# EAGLE design NRF24-mini-SHIM (EAGLE 9.6.2)
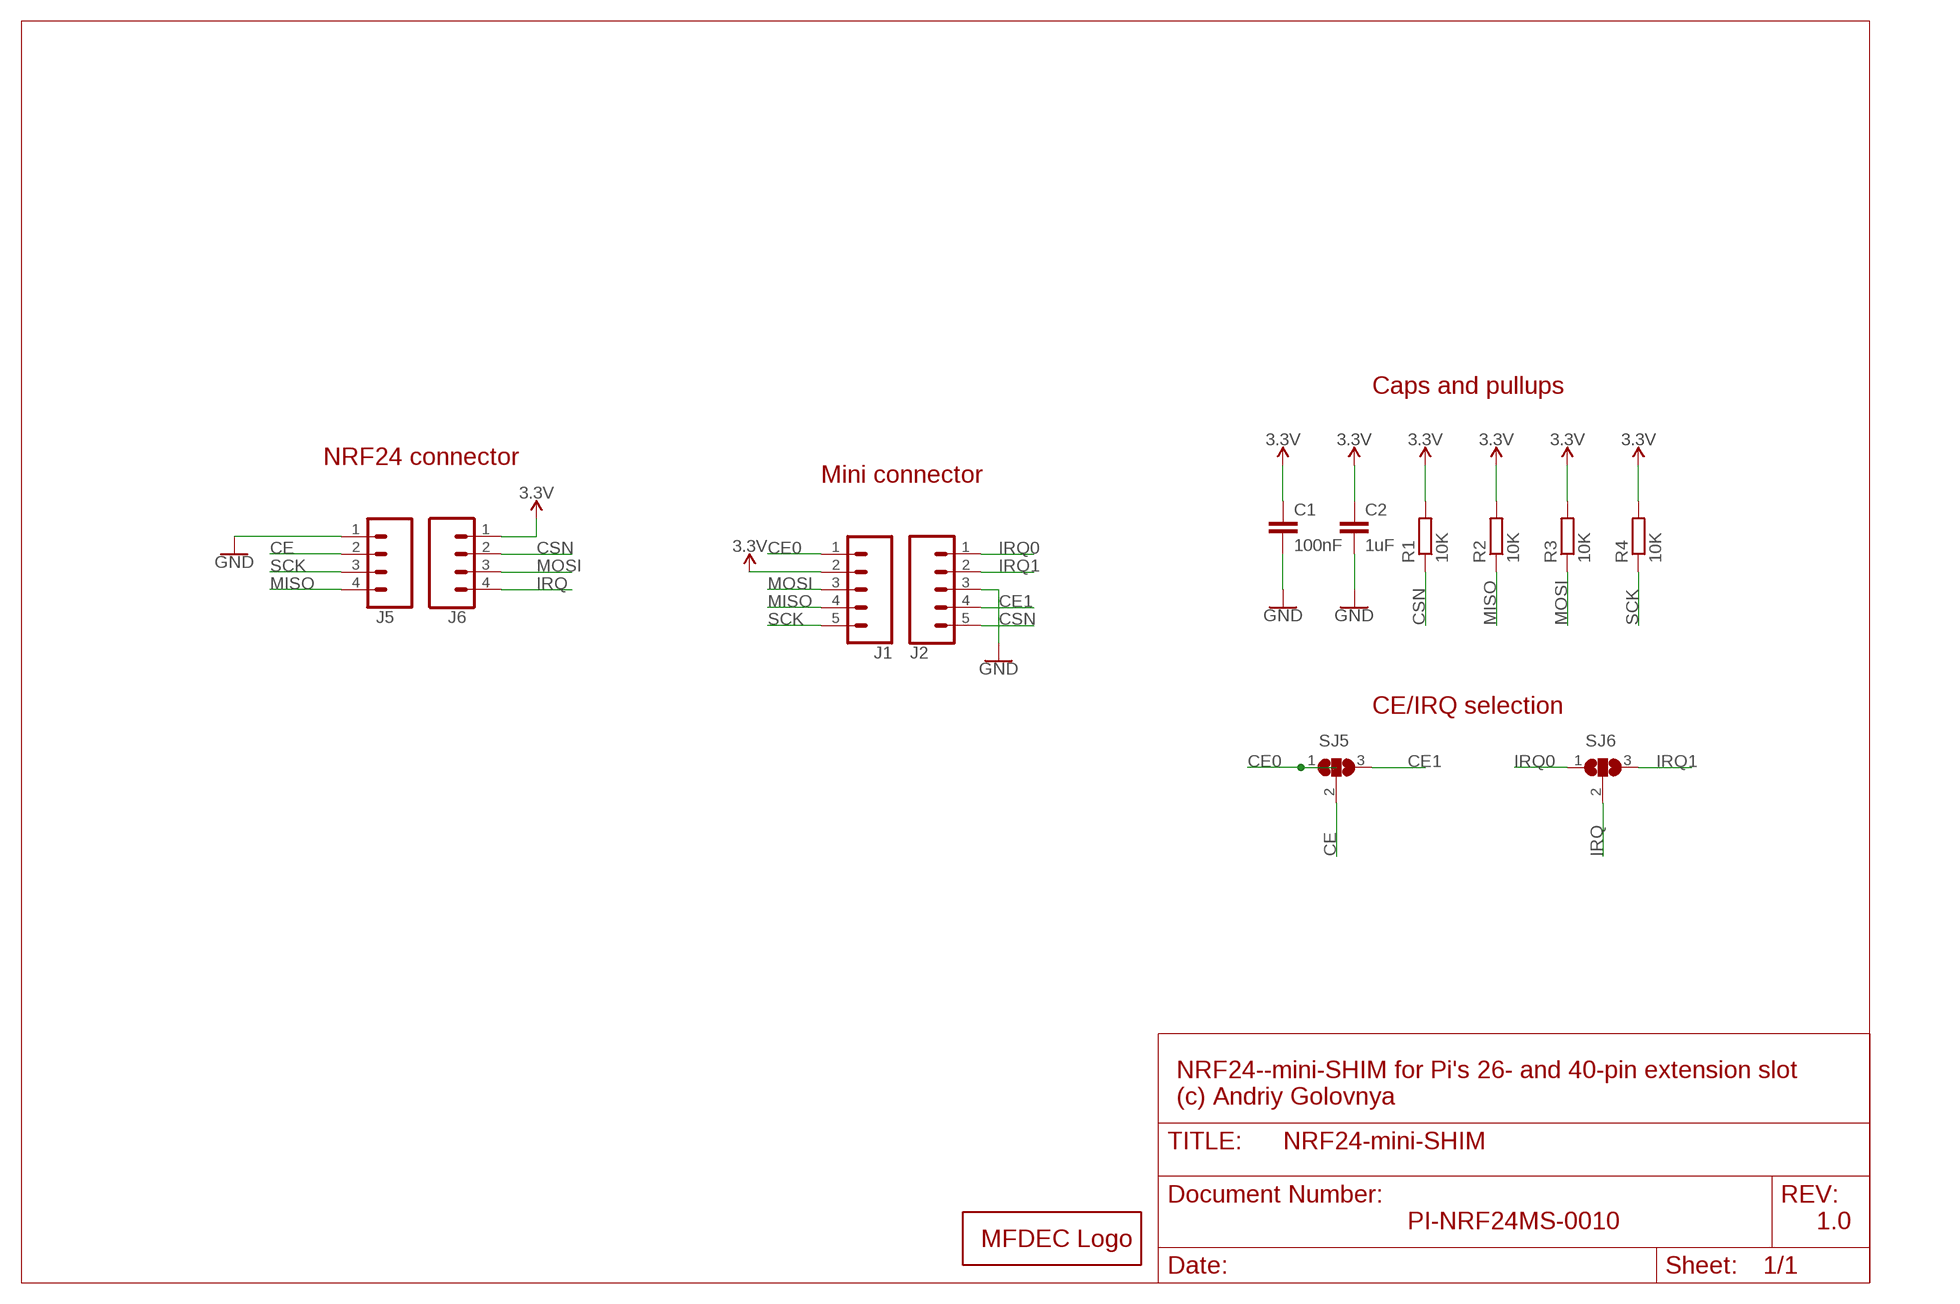
[diagram p0: schematic, sheet 1]

## Parts
C1  100nF  C-EUC0402  [C0402]
C2  1uF  C-EUC0603  [C0603]
J1  CONN_05LOCK  [1X05_LOCK]
J2  CONN_05LOCK  [1X05_LOCK]
J5  CONN_04LOCK  [1X04_LOCK]
J6  CONN_04LOCK  [1X04_LOCK]
LOGO1  MFDECLOGO_L_10MM  [MFDEC_L_10MM]
R1  10K  R-EU_R0402  [R0402]
R2  10K  R-EU_R0402  [R0402]
R3  10K  R-EU_R0402  [R0402]
R4  10K  R-EU_R0402  [R0402]
SJ5  SJ2  [SJ_2]
SJ6  SJ2  [SJ_2]

## Nets
3.3V: C1.1 C2.1 J1.2 J6.1 R1.2 R2.2 R3.2 R4.2
CE: J5.2 SJ5.2
CE0: J1.1 SJ5.1
CE1: J2.4 SJ5.3
CSN: J2.5 J6.2 R1.1
GND: C1.2 C2.2 J2.3 J5.1
IRQ: J6.4 SJ6.2
IRQ0: J2.1 SJ6.1
IRQ1: J2.2 SJ6.3
MISO: J1.4 J5.4 R2.1
MOSI: J1.3 J6.3 R3.1
SCK: J1.5 J5.3 R4.1

## Notes on the sheet
- Caps and pullups
- NRF24 connector
- Mini connector
- CE/IRQ selection
- NRF24--mini-SHIM for Pi's 26- and 40-pin extension slot
  (c) Andriy Golovnya
- PI-NRF24MS-0010 | 1.0

## Library data of the parts
C1 C2 = rcl:C-EU: CAPACITOR, European symbol; SPICEPREFIX: C
J1 J2 = _my_locked_connectors:CONN_05: Multi connection point. Often used as Generic Header-pin footprint for 0.1 inch spaced/style header connections On any of the 0.1 inch spaced packages, you can populate with these: Break Away Headers - Straight <https://www.sparkfun.com/products/116> (PRT-00116) Break Away Male Headers - Right Angle <https://www.sparkfun.com/products/553> (PRT-00553) Female Headers <https://www.sparkfun.com/products/115> (PRT-00115) Break Away Headers - Machine Pin <https://www.sparkfun.com/products/117> (PRT-00117) Break Away Female Headers - Swiss Machine Pin <https://www.sparkfun.com/products/743> (PRT-00743) For SCREWTERMINALS and SPRING TERMINALS visit here: Screw Terimnals on SparkFun.com <https://www.sparkfun.com/search/results?term=Screw+Terminals> (5mm/3.5mm/2.54mm spacing) This device is also useful as a general connection point to wire up your design to another part of your project. Our various solder wires solder well into these plated through hole pads. Hook-Up Wire - Assortment (Stranded, 22 AWG) <https://www.sparkfun.com/products/11375> (PRT-11375) Hook-Up Wire - Assortment (Solid Core, 22 AWG) <https://www.sparkfun.com/products/11367> (PRT-11367) View the entire wire category on our website here <https://www.sparkfun.com/categories/141> Special notes: Molex polarized connector foot print use with SKU : PRT-08231 with associated crimp pins and housings. 1MM SMD Version SKU: PRT-10208
J5 J6 = _my_locked_connectors:CONN_04: Multi connection point. Often used as Generic Header-pin footprint for 0.1 inch spaced/style header connections On any of the 0.1 inch spaced packages, you can populate with these: Break Away Headers - Straight <https://www.sparkfun.com/products/116> (PRT-00116) Break Away Male Headers - Right Angle <https://www.sparkfun.com/products/553> (PRT-00553) Female Headers <https://www.sparkfun.com/products/115> (PRT-00115) Break Away Headers - Machine Pin <https://www.sparkfun.com/products/117> (PRT-00117) Break Away Female Headers - Swiss Machine Pin <https://www.sparkfun.com/products/743> (PRT-00743) For SCREWTERMINALS and SPRING TERMINALS visit here: Screw Terimnals on SparkFun.com <https://www.sparkfun.com/search/results?term=Screw+Terminals> (5mm/3.5mm/2.54mm spacing) This device is also useful as a general connection point to wire up your design to another part of your project. Our various solder wires solder well into these plated through hole pads. Hook-Up Wire - Assortment (Stranded, 22 AWG) <https://www.sparkfun.com/products/11375> (PRT-11375) Hook-Up Wire - Assortment (Solid Core, 22 AWG) <https://www.sparkfun.com/products/11367> (PRT-11367) View the entire wire category on our website here <https://www.sparkfun.com/categories/141> Special notes: Molex polarized connector foot print use with SKU : PRT-08231 with associated crimp pins and housings. 1MM SMD Version SKU: PRT-10208; PROD_ID: CONN-09696
LOGO1 = _my_logos:MFDECLOGO: Midnight Fog - Digital Eye Candy LOGO
R1-R4 = rcl:R-EU_: RESISTOR, European symbol; SPICEPREFIX: R
SJ5 SJ6 = _my_jumpers:SJ2: SMD solder JUMPER SJ2 - simple jumper SJ2FI - fancy inside jumper SJ2FO - fancy outside jumper SJ2FL - fancy left jumper SJ2FR - fancy right jumper SJ2W - wide jumper

## Board
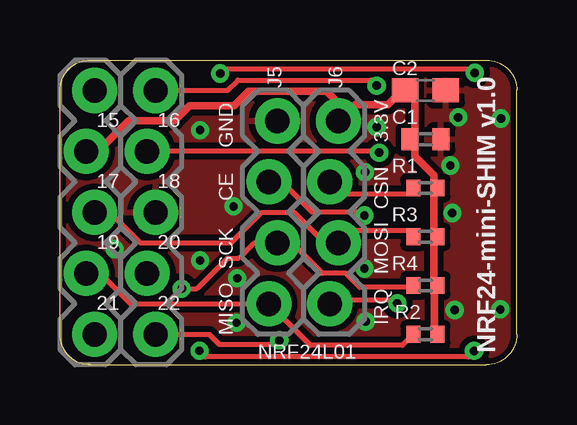
[diagram p1: board, top side]
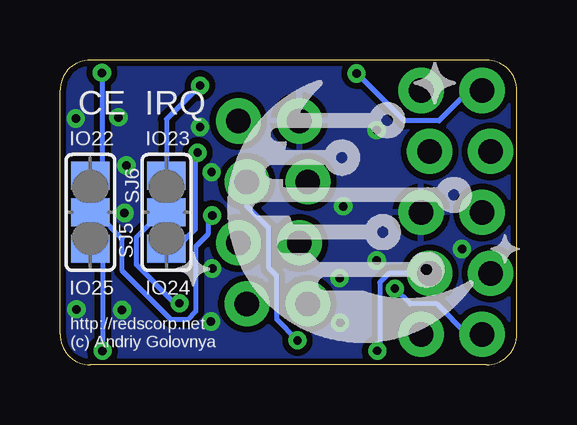
[diagram p2: board, bottom side, seen from below]

Size 19.05 x 12.7 mm. Coordinates in mm from the lower left corner, seen from the top.
Outline: 1.27,0 17.78,0 arc90 19.05,1.27 19.05,11.43 arc90 17.78,12.7 1.27,12.7 arc90 0,11.43 0,1.27 arc90 1.27,0
Copper layers (1*16): Top 0.035mm / dielectric 1.5mm / Bottom 0.035mm
Design rules "default *": minimum track width 6mil, minimum drill 0.35mm, track to track 6mil, track to pad 6mil, pad to pad 6mil, via to via 6mil, smd to smd 6mil, copper to edge 6mil, drill to drill 6mil, minimum pad ring 10mil, minimum via ring 8mil, stop-mask expansion 4mil, vias tented up to drill 20mil, thermal gap 10mil

### Footprints (pad centres in the part's own frame; a part is rotated, then mirrored left to right if it is on the bottom)
C0402 = smd 0.7 x 0.9: 1 -0.65,0; 2 0.65,0
C0603 = smd 1.1 x 1: 1 -0.85,0; 2 0.85,0
1X05_LOCK = drill 1.016 pad 1.88: 1 0,0.178; 2 2.54,-0.178; 3 5.08,0.178; 4 7.62,-0.178; 5 10.16,0.178
1X04_LOCK = drill 1.016 pad 1.88: 1 0,0.178; 2 2.54,-0.178; 3 5.08,0.178; 4 7.62,-0.178
R0402 = smd 0.6 x 0.7: 1 -0.5,0; 2 0.5,0
SJ_2 = smd 1.168 x 1.6: 1 -1.524,0; 2 0,0; 3 1.524,0

### Placement (x,y rotation side)
C1  15.24,9.4 0 top
C2  15.24,11.43 0 top
J1  1.27,11.43 270 top
J2  3.81,11.43 270 top
J5  8.89,10.16 270 top
J6  11.43,10.16 270 top
LOGO1  14.99,0 0 bottom
R1  15.24,7.37 0 top
R2  15.24,1.27 0 top
R3  15.24,5.33 0 top
R4  15.24,3.3 0 top
SJ5  17.78,6.35 270 bottom
SJ6  14.61,6.35 270 bottom

### Tracks (layer width: path | path; a pad name or v marks a point on that pad's centre or on a via)
3.3V
  Top 0.305: J1.2 1.6,8.89 2.87,10.16 4.78,10.16 5.41,10.79 7.26,10.79 7.87,11.4 11.11,11.4 11.61,10.9 J6.1 12.29,10.85 13.68,10.85 14.26,11.43 C2.1 14.79,11.03 14.79,9.6 C1.1 14.79,9.2 14.79,8.69 15.59,7.89 15.59,7.52 R1.2 15.59,7.21 15.59,5.49 R3.2 15.59,5.18 15.59,3.45 R4.2 15.61,3.17 15.61,1.4 R2.2
CE  (via drill 0.35)
  Top 0.203: J5.2 9.26,7.62 10.5,6.38 12.55,6.38 v12.7,6.22
  Bottom 0.152: SJ5.2 17.78,7.44
  Bottom 0.203: SJ5.2 17.65,6.22 17.41,6.22 16.45,5.26 16.45,3.92 14.4,1.88 13.73,1.88 13.39,2.23 13.39,4.93 12.88,5.44 12.88,6.04 v12.7,6.22
CE0  (via drill 0.35)
  Top 0.203: v6.68,12.14 6.85,12.31 17.15,12.31 v17.3,12.17
  Bottom 0.203: J1.1 1.97,11.43 3.24,10.16 4.68,10.16 6.66,12.14 v6.68,12.14 | v17.3,12.17 17.3,8.23 17.65,7.87 SJ5.1
CE1  (via drill 0.35)
  Top 0.203: v5.82,0.58 6.07,0.33 17.02,0.33 v17.27,0.58
  Bottom 0.203: v5.82,0.58 5.71,0.69 5.71,3.44 5.34,3.81 J2.4 | SJ5.3 17.53,4.83 17.27,4.57 v17.27,0.58
CSN  (via drill 0.35)
  Top 0.203: R1.1 14.49,7.11 11.76,7.11 J6.2 | J2.5 6.22,1.27 6.66,0.84 8.97,0.84 v9.14,1.02
  Bottom 0.203: v9.14,1.02 v9.14,1.03 10.01,1.89 10.01,3.7 10.34,4.03 10.34,5.69 11.25,6.6 J6.2
GND  (via drill 0.35)
  other vias: 7.39,3.61 7.24,6.6 5.84,9.78 16.46,2.29 18.36,2.31 18.39,10.26 2.29,4.83 5.84,4.34 16.61,10.31 7.37,1.75 12.73,8.03 13.21,9.91 12.75,1.8 12.7,4.01 16.36,6.32 16.28,8.31
  pour Top (isolate 0.254): 0,0 0,12.7 21.72,12.7 21.72,0
  pour Bottom (isolate 0.254): 0,0 0,12.7 24.26,12.7 24.26,0
IRQ  (via drill 0.35)
  Top 0.203: v14.07,2.56 13.94,2.69 11.4,2.69 J6.4
  Bottom 0.203: v14.07,2.56 14.27,2.56 15.86,4.16 15.86,5.31 14.82,6.35 SJ6.2
IRQ0  (via drill 0.35)
  Top 0.203: J2.1 6.99,11.43 7.42,11.86 12.98,11.86 v13.21,11.63
  Bottom 0.203: v13.21,11.63 14.61,10.24 SJ6.1
IRQ1  (via drill 0.35)
  Top 0.203: v13.31,8.84 13.26,8.89 J2.2
  Bottom 0.203: v13.31,8.84 13.41,8.74 13.41,5.64 14.22,4.83 SJ6.3
MISO
  Top 0.203: R2.1 14.28,0.81 10.44,0.81 J5.4 2.95,2.54 1.68,3.81 J1.4
MOSI
  Top 0.203: R3.1 14.49,5.59 12.12,5.59 J6.3 11.04,5.08 9.77,6.35 8.41,6.35 7.14,5.08 3.35,5.08 2.08,6.35 J1.3
SCK  (via drill 0.35)
  Top 0.203: R4.1 14.66,3.23 12.51,3.23 11.92,3.81 10.95,3.81 9.68,5.08 J5.3 8.1,5.08 7.47,4.45 6.99,4.45 5.71,3.17 v5.08,3.17
  Bottom 0.203: J1.5 2.07,1.27 3.34,2.54 4.45,2.54 v5.08,3.17

### Text on the board
tPlace: GND | 3.3V | 15 | 16 | CE | CSN | 17 | 18 | SCK | MOSI | 19 | 20 | MISO | IRQ | 21 | 22 | NRF24-mini-SHIM v1.0 | NRF24L01
bPlace: CE IRQ | IO23 | IO22 | IO24 | IO25 | http://redscorp.net / (c) Andriy Golovnya